# EAGLE schematic shield (EAGLE 9.6.2)
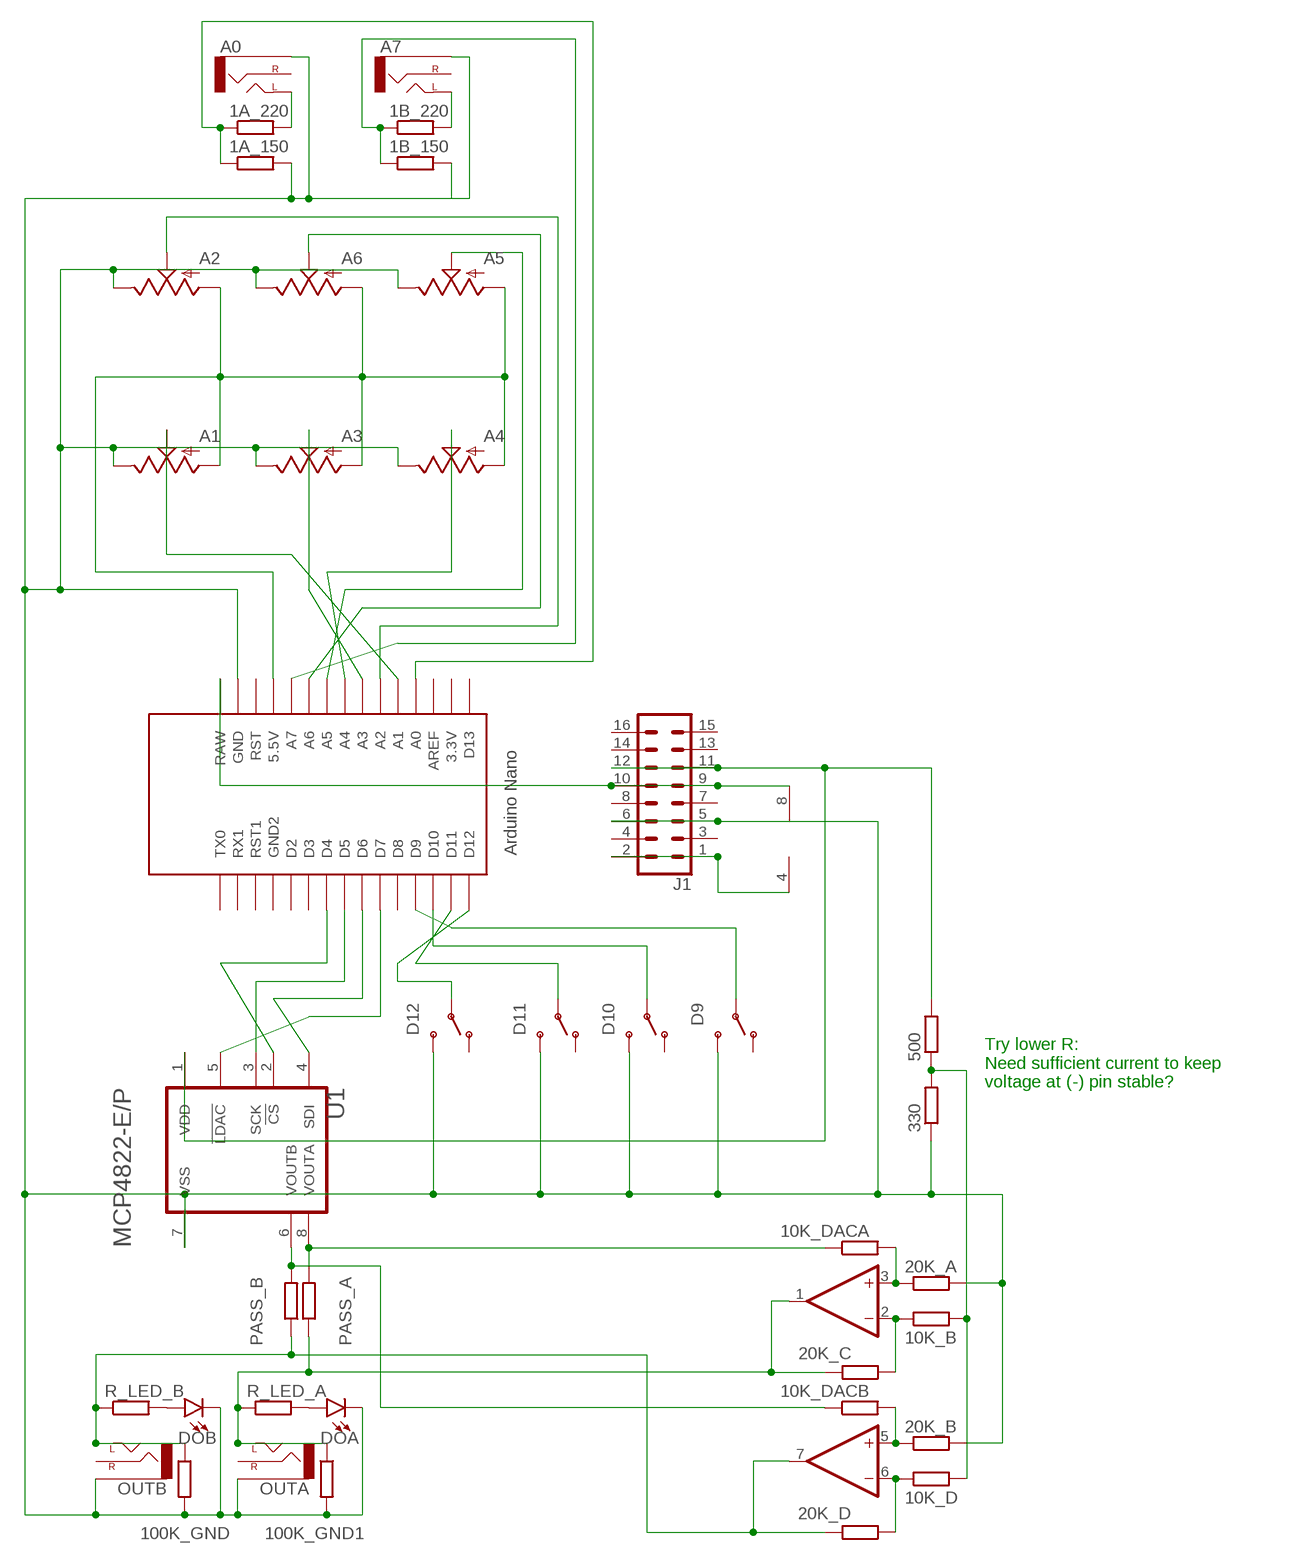
[diagram p0: schematic, sheet 1]

## Parts
1A_150  RESISTOR7MM  [7MM_RESISTOR]
1A_220  RESISTOR7MM  [7MM_RESISTOR]
1B_150  RESISTOR7MM  [7MM_RESISTOR]
1B_220  RESISTOR7MM  [7MM_RESISTOR]
10K_B  RESISTOR7MM  [7MM_RESISTOR]
10K_D  RESISTOR7MM  [7MM_RESISTOR]
10K_DACA  RESISTOR7MM  [7MM_RESISTOR]
10K_DACB  RESISTOR7MM  [7MM_RESISTOR]
20K_A  RESISTOR7MM  [7MM_RESISTOR]
20K_B  RESISTOR7MM  [7MM_RESISTOR]
20K_C  RESISTOR7MM  [7MM_RESISTOR]
20K_D  RESISTOR7MM  [7MM_RESISTOR]
100K_GND  RESISTOR7MM  [7MM_RESISTOR]
100K_GND1  RESISTOR7MM  [7MM_RESISTOR]
330  RESISTOR7MM  [7MM_RESISTOR]
500  RESISTOR7MM  [7MM_RESISTOR]
A0  THONKI-STEREO  [WQP-PJ366ST_JACK]
A1  9MM_SNAP-IN_POT_  [9MM_SNAP-IN_POT]
A2  9MM_SNAP-IN_POT_  [9MM_SNAP-IN_POT]
A3  9MM_SNAP-IN_POT_  [9MM_SNAP-IN_POT]
A4  9MM_SNAP-IN_POT_  [9MM_SNAP-IN_POT]
A5  9MM_SNAP-IN_POT_  [9MM_SNAP-IN_POT]
A6  9MM_SNAP-IN_POT_  [9MM_SNAP-IN_POT]
A7  THONKI-STEREO  [WQP-PJ366ST_JACK]
D9  SUBMINI_SPDT  [SUBMINI_TOGGLE]
D10  SUBMINI_SPDT  [SUBMINI_TOGGLE]
D11  SUBMINI_SPDT  [SUBMINI_TOGGLE]
D12  SUBMINI_SPDT  [SUBMINI_TOGGLE]
DOA  LED3MM  [LED_3MM]
DOB  LED3MM  [LED_3MM]
IC1  TL072P  [DIL08]
J1  CONN_08X2  [2X8]
OUTA  THONKI-STEREO  [WQP-PJ366ST_JACK]
OUTB  THONKI-STEREO  [WQP-PJ366ST_JACK]
PASS_A  RESISTOR7MM  [7MM_RESISTOR]
PASS_B  RESISTOR7MM  [7MM_RESISTOR]
R_LED_A  RESISTOR7MM  [7MM_RESISTOR]
R_LED_B  RESISTOR7MM  [7MM_RESISTOR]
U1  MICROCHIP_MCP4822-E-PMICROCHIP_MCP4822-E-P_0_0  [MICROCHIP_MCP4822-E-P_0]
U$1  NANO  [NANO]

## Nets
N$1: D12.COM(COMMON) U$1.D12
N$2: D11.COM(COMMON) U$1.D11
N$3: A1.2(S) U$1.A1
N$4: 1A_150.2 1B_150.2 20K_A.2 20K_B.2 100K_GND1.2 100K_GND.2 330.1 A0.P$3_SLEEVE(SLEEVE) A1.3(E) A2.3(E) A3.3(E) A4.3(E) A5.3(E) A6.3(E) A7.P$3_SLEEVE(SLEEVE) D9.3(S) D10.3(S) D11.3(S) D12.3(S) DOA.K(C) DOB.K(C) J1.5 J1.6 OUTA.P$3_SLEEVE(SLEEVE) OUTB.P$3_SLEEVE(SLEEVE) U1.7(VSS) U$1.GND
N$5: D10.COM(COMMON) U$1.D10
N$6: 1A_150.1 1A_220.1 U$1.A0
N$7: 1A_220.2 A0.P$1_TIP(LEFT)
N$8: A1.1(A) A2.1(A) A3.1(A) A4.1(A) A5.1(A) A6.1(A) U$1.5V(5.5V)
N$9: A2.2(S) U$1.A2
N$10: IC1.4(P:V-) J1.1 J1.2
N$11: A3.2(S) U$1.A3
N$12: A6.2(S) U$1.A6
N$13: 10K_DACA.1 PASS_A.2 U1.8(VOUTA)
N$14: 10K_DACB.1 PASS_B.2 U1.6(VOUTB)
N$15: A4.2(S) U$1.A4
N$16: 1B_150.1 1B_220.1 U$1.A7
N$17: A5.2(S) U$1.A5
N$18: 20K_C.2 100K_GND1.1 IC1.1(A:OUT) OUTA.P$1_TIP(LEFT) PASS_A.1 R_LED_A.1
N$19: D9.COM(COMMON) U$1.D9
N$20: 10K_D.1 20K_D.1 IC1.6(B:-IN)
N$21: 10K_DACA.2 20K_A.1 IC1.3(A:+IN)
N$22: 10K_B.1 20K_C.1 IC1.2(A:-IN)
N$23: 10K_DACB.2 20K_B.1 IC1.5(B:+IN)
N$24: 1B_220.2 A7.P$1_TIP(LEFT)
N$25: 10K_B.2 10K_D.2 330.2 500.1
N$27: 20K_D.2 100K_GND.1 IC1.7(B:OUT) OUTB.P$1_TIP(LEFT) PASS_B.1 R_LED_B.1
N$30: U1.2(!CS!) U$1.D4
N$31: U1.3(SCK) U$1.D5
N$32: U1.4(SDI) U$1.D6
N$33: U1.5(!LDAC!) U$1.D7
N$38: DOB.A R_LED_B.2
N$39: DOA.A R_LED_A.2
N$46: 500.2 J1.11 J1.12 U1.1(VDD)
N$47: IC1.8(P:V+) J1.9 J1.10 U$1.RAW
Unconnected: A0.P$2_SWITCH(RIGHT) A7.P$2_SWITCH(RIGHT) D9.1(O) D10.1(O) D11.1(O) D12.1(O) J1.3 J1.4 J1.7 J1.8 J1.13 J1.14 J1.15 J1.16 OUTA.P$2_SWITCH(RIGHT) OUTB.P$2_SWITCH(RIGHT) U$1.3.3V U$1.AREF U$1.D2 U$1.D3 U$1.D8 U$1.D13 U$1.GND1(GND2) U$1.ICSP1 U$1.ICSP2 U$1.ICSP3 U$1.ICSP4 U$1.ICSP5 U$1.ICSP6 U$1.RST U$1.RST1 U$1.RX1 U$1.TX0

## Notes on the sheet
- Try lower R:
  Need sufficient current to keep
  voltage at (-) pin stable?

## Library data of the parts
1A_150 1A_220 1B_150 1B_220 10K_B 10K_D 10K_DACA 10K_DACB 20K_A 20K_B 20K_C 20K_D 100K_GND 100K_GND1 330 500 PASS_A PASS_B R_LED_A R_LED_B = MusicThingModular:RESISTOR: Standard resistor, various versions
A0 A7 OUTA OUTB = MusicThingModular:THONKI-STEREO: 3.5mm socket for Eurorack modular synths
A1-A6 = MusicThingModular:9MM_SNAP-IN_POT: 9mm vertical snap-in pot, Alpha / Panasonic style
D9-D12 = MusicThingModular:SUBMINI_SPDT
DOA DOB = SparkFun-LED:LED: LED (Generic) Standard schematic elements and footprints for 5mm, 3mm, 1206, and 0603 sized LEDs. Generic LEDs with no color specified.; PROD_ID: DIO-08794
IC1 = linear:TL072: OP AMP
J1 = SparkFun-Connectors:CONN_08X2: Multi connection point. Often used as Generic Header-pin footprint for 0.1 inch spaced/style header connections You can populate with any combo of single row headers, but if you'd like an exact match, check this: Header - 2x8 (Male, 0.1") <https://www.sparkfun.com/products/13156> (PRT-13156) On any of the 0.1 inch spaced packages, you can populate with these: Break Away Headers - Straight <https://www.sparkfun.com/products/116> (PRT-00116) Break Away Male Headers - Right Angle <https://www.sparkfun.com/products/553> (PRT-00553) Female Headers <https://www.sparkfun.com/products/115> (PRT-00115) Break Away Headers - Machine Pin <https://www.sparkfun.com/products/117> (PRT-00117) Break Away Female Headers - Swiss Machine Pin <https://www.sparkfun.com/products/743> (PRT-00743)
U1 = MCP4822-DIP:MICROCHIP_MCP4822-E-P: CON-DAC-MCP4822-8; CIIVA_IDS: 2294762; CODE__JEDEC: MS-001; COMPONENT_LINK_1_DESCRIPTION: Manufacturer URL; COMPONENT_LINK_1_URL: http://www.microchip.com/; COMPONENT_LINK_3_DESCRIPTION: Package Specification; COMPONENT_LINK_3_URL: http://www.microchip.com/stellent/groups/techpub_sg/documents/packagingspec/en012702.pdf; DATASHEET: http://ww1.microchip.com/downloads/en/DeviceDoc/22249A.pdf; DATASHEET_VERSION: revA, Apr-2010; FOOTPRINT_VARIANT_NAME_0: Manufacturer Recommended; IMPORTED: yes; IMPORTED_FROM: vault; IMPORT_TS: 1521866553; MF: Microchip; MPN: MCP4822-E/P; PACKAGE: PDIP300-P8; PACKAGE_DESCRIPTION: 8-Lead Plastic Dual In-Line (P) - 300 mil Body [PDIP]; PACKAGE_VERSION: revBB, Aug-2009; PIN_0_0_3_INSIDE_EDGE: clock; PREFIX: U; RELEASE_DATE: 1331947821; VAULT_GUID: 94E75BEE-D2D1-4E0D-ABEB-B73911AD75B5; VAULT_REVISION: C4C10C9A-AFC4-4D2D-B34D-EBD3545DE0A8
U$1 = Arduino-clone:NANO: Arduino Nano